# EAGLE design Amp (EAGLE 6.2)
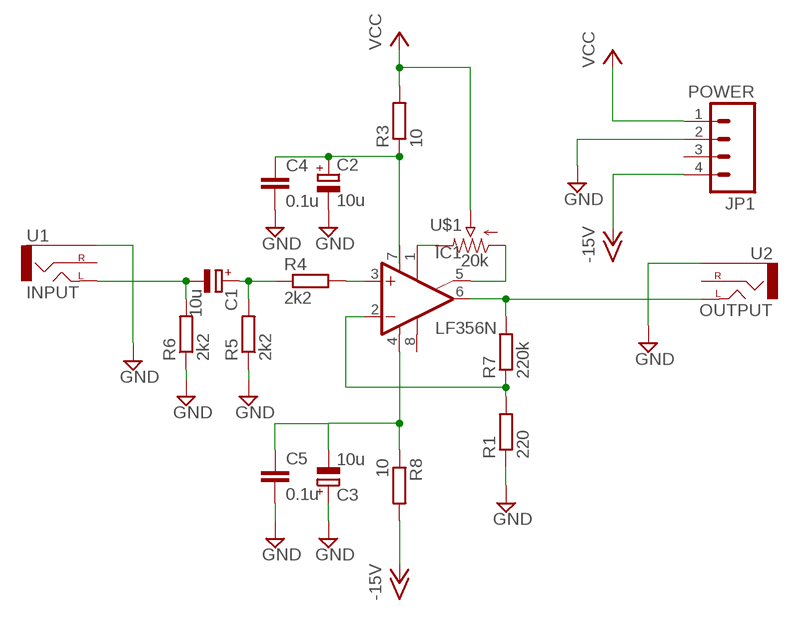
[diagram p0: schematic, sheet 1]

## Parts
C1  10u  CPOL-EUE1.8-4  [E1,8-4]
C2  10u  CPOL-EUE1.8-4  [E1,8-4]
C3  10u  CPOL-EUE1.8-4  [E1,8-4]
C4  0.1u  C-EU025-024X044  [C025-024X044]
C5  0.1u  C-EU025-024X044  [C025-024X044]
IC1  LF356N  [DIL08]
JP1  POWER  M04POLAR  [MOLEX-1X4]
R1  220  R-EU_0204/5  [0204/5]
R3  10  R-EU_0204/5  [0204/5]
R4  2k2  R-EU_0204/5  [0204/5]
R5  2k2  R-EU_0204/5  [0204/5]
R6  2k2  R-EU_0204/5  [0204/5]
R7  220k  R-EU_0204/5  [0204/5]
R8  10  R-EU_0204/5  [0204/5]
U1  INPUT  AUDIO-JACKHOLESONLY  [STEREOJACK2.5MM_SPECIAL_HOLES-ONLY]
U2  OUTPUT  AUDIO-JACKHOLESONLY  [STEREOJACK2.5MM_SPECIAL_HOLES-ONLY]
U$1  20k  POT100K_3362U  [3362U]

## Nets
-15V: JP1.4 R8.2
GND: C2.- C3.+ C4.2 C5.2 JP1.2 R1.1 R5.1 R6.1 U1.RING1(SLEEVE) U2.RING1(SLEEVE)
N$1: C1.- R6.2 U1.SHIELD(LEFT)
N$2: C1.+ R4.1 R5.2
N$4: IC1.2(-IN) R1.2 R7.1
N$5: C3.- C5.1 IC1.4(V-) R8.1
N$6: IC1.3(+IN) R4.2
N$7: IC1.6(OUT) R7.2 U2.SHIELD(LEFT)
N$9: C2.+ C4.1 IC1.7(V+) R3.1
N$12: IC1.5(ON2) U$1.P$3(A)
N$13: IC1.1(ON1) U$1.P$1(E)
VCC: JP1.1 R3.2 U$1.P$2(S)
Unconnected: IC1.8(OPT) JP1.3 U1.TIP(RIGHT) U2.TIP(RIGHT)

## Library data of the parts
C1-C3 = rcl:CPOL-EU: POLARIZED CAPACITOR, European symbol
C4 C5 = rcl:C-EU: CAPACITOR, European symbol
IC1 = linear:LF356: OP AMP
JP1 = SparkFun:M04: Header 4 Standard 4-pin 0.1" header. Use with straight break away headers (SKU : PRT-00116), right angle break away headers (PRT-00553), swiss pins (PRT-00743), machine pins (PRT-00117), and female headers (PRT-00115). Molex polarized connector foot print use with SKU : PRT-08231 with associated crimp pins and housings. 1MM SMD Version SKU: PRT-10208
R1 R3-R8 = rcl:R-EU_: RESISTOR, European symbol
U1 U2 = SparkFun:AUDIO-JACK: 3.5mm Audio Jack Simple 3.5mm common PCB mount audio jack. SKU: PRT-08032
U$1 = My Library:POT

## Board
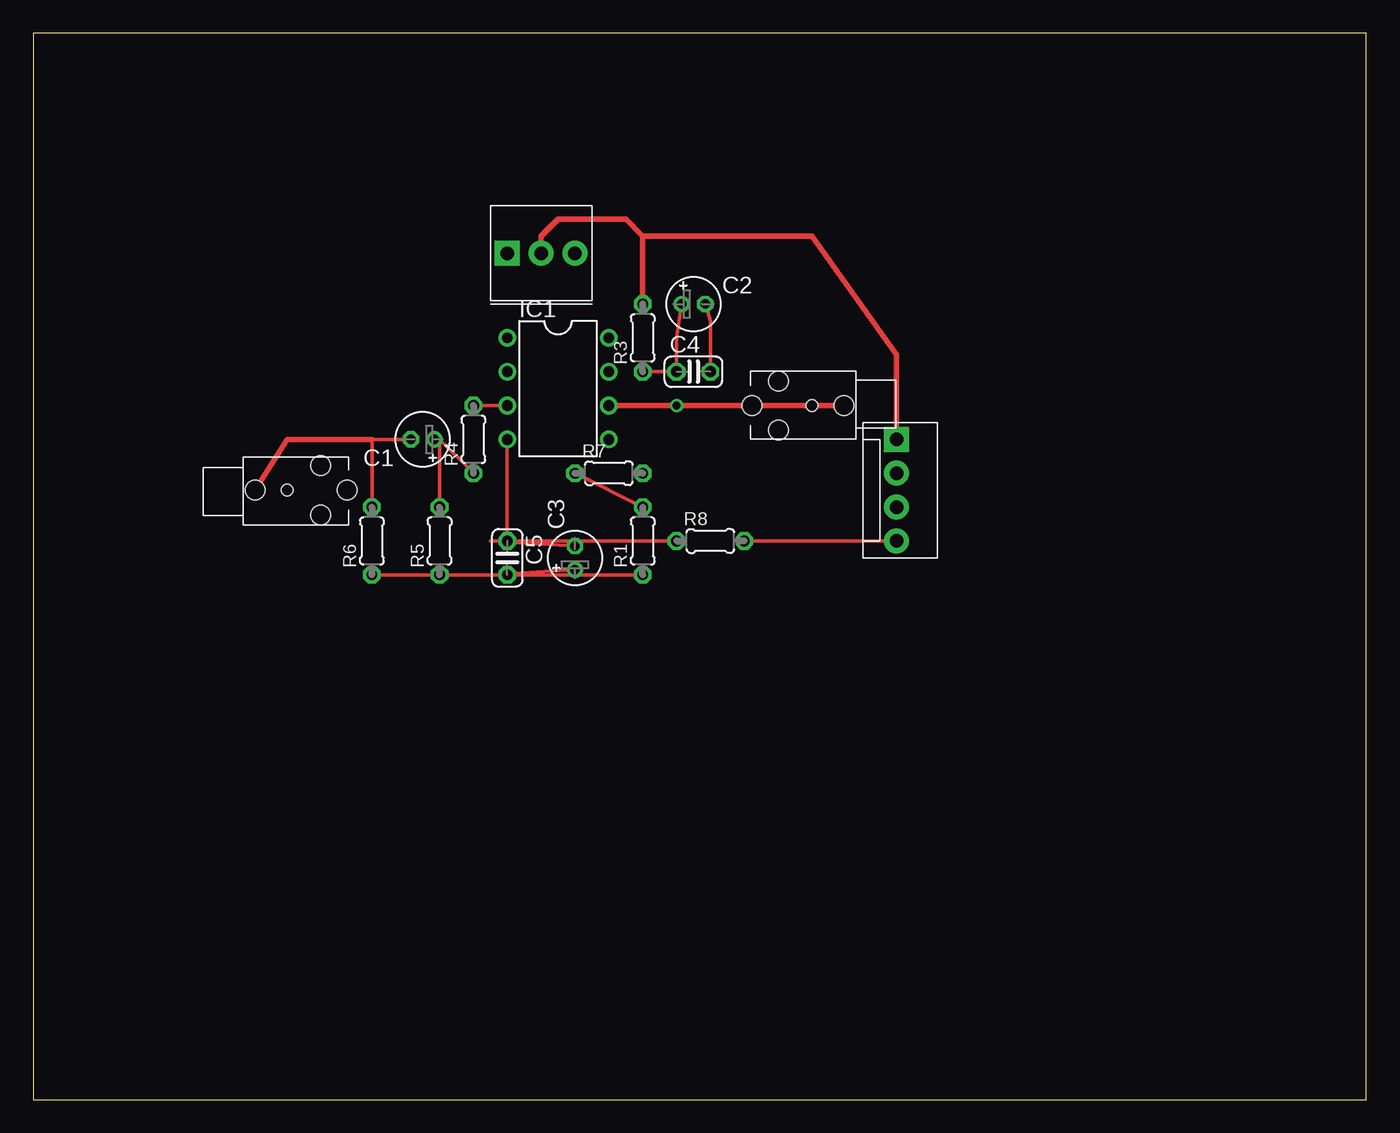
[diagram p1: board, top side]
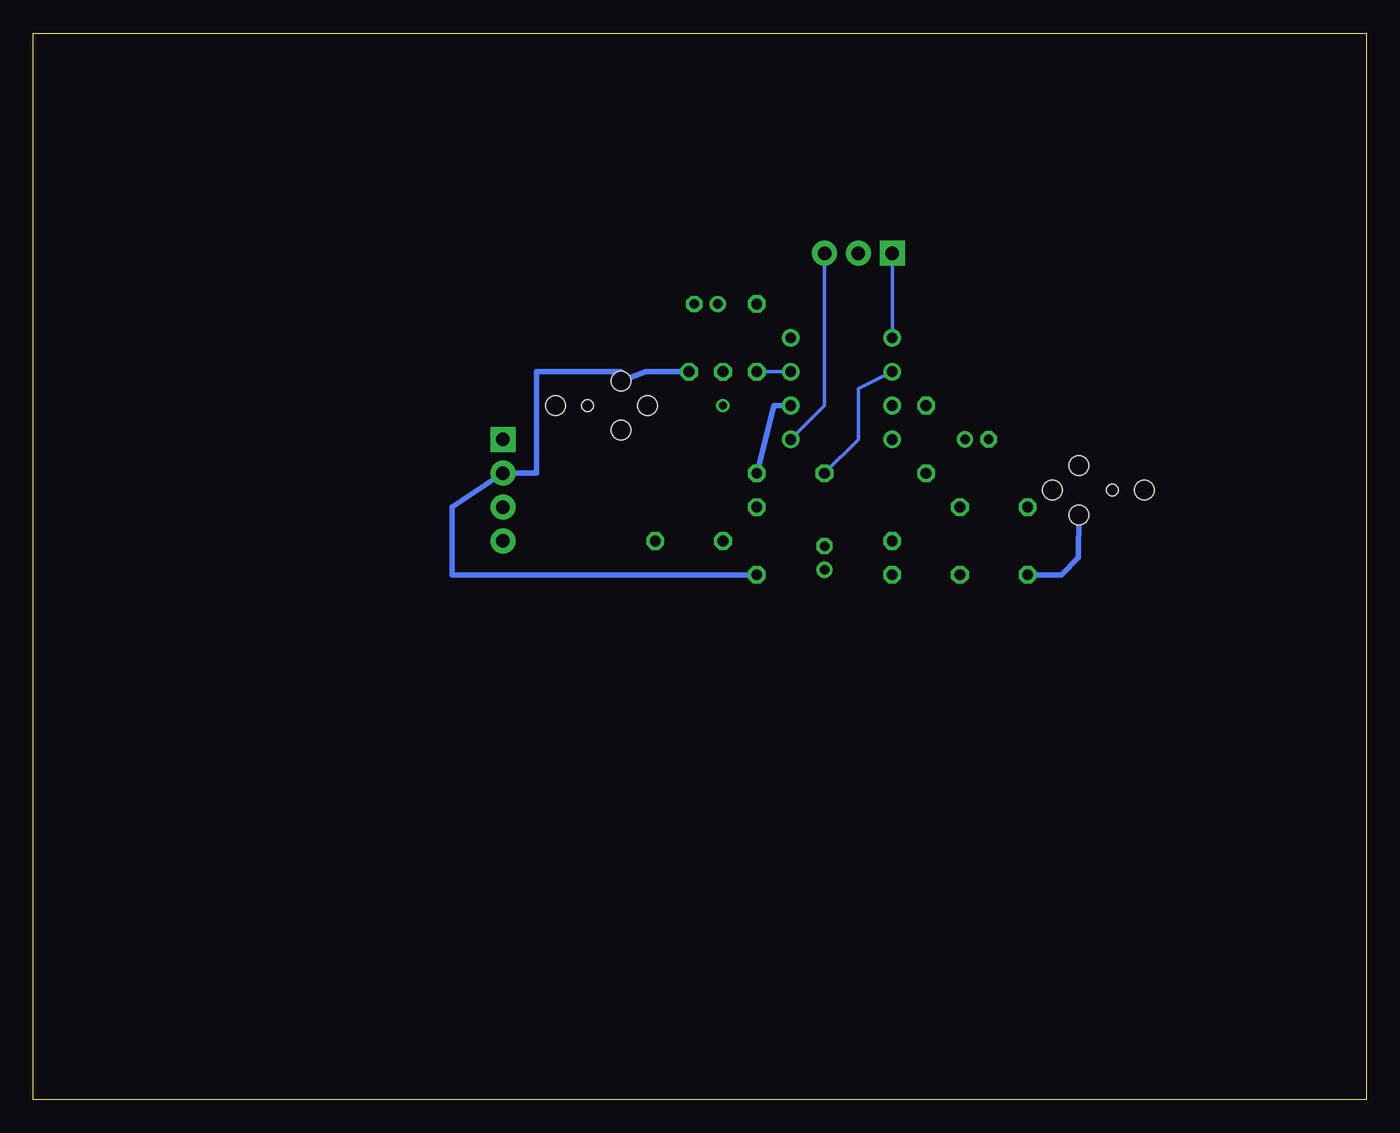
[diagram p2: board, bottom side, seen from below]

Size 100 x 80 mm. Coordinates in mm from the lower left corner, seen from the top.
Outline: 0,0 100,0 100,80 0,80 0,0
Copper layers (1*16): Top 0.035mm / dielectric 1.5mm / Bottom 0.035mm
Design rules: minimum track width 10mil, minimum drill 24mil, track to track 8mil, track to pad 8mil, pad to pad 8mil, via to via 8mil, smd to smd 8mil, copper to edge 40mil, drill to drill 8mil, minimum pad ring 10mil, minimum via ring 8mil, stop-mask expansion 4mil, vias tented up to drill 0mil, thermal gap 10mil

### Footprints (pad centres in the part's own frame; a part is rotated, then mirrored left to right if it is on the bottom)
E1,8-4 = drill 0.711 pad 1.168: + -0.889,0 | drill 0.711 pad 1.168 octagon: - 0.889,0
C025-024X044 = drill 0.813 octagon: 1 -1.27,0; 2 1.27,0
DIL08 = drill 0.813 pad 1.27: 1 -3.81,-3.81; 2 -1.27,-3.81; 3 1.27,-3.81; 4 3.81,-3.81; 5 3.81,3.81; 6 1.27,3.81; 7 -1.27,3.81; 8 -3.81,3.81
MOLEX-1X4 = drill 1.016 pad 1.88 square: 1 0,0 | drill 1.016 pad 1.88: 2 2.54,0; 3 5.08,0; 4 7.62,0
0204/5 = drill 0.813 octagon: 1 -2.54,0; 2 2.54,0
STEREOJACK2.5MM_SPECIAL_HOLES-ONLY = drill 0.889 pad 0.813: RING1 2.5,-1.85; RING2 2.5,1.85; SHIELD -2.4,0; TIP 4.5,0 | hole 0.889: 0,0 | hole 1.473: -2.4,0; 2.5,1.85; 4.5,0; 2.5,-1.85
3362U = drill 1.016 pad 1.88 square: P$1 0,2.54 | drill 1.016 pad 1.88: P$2 2.54,2.54; P$3 5.08,2.54

### Placement (x,y rotation side)
C1  29.21,49.53 180 top
C2  49.53,59.69 0 top
C3  40.64,40.64 90 top
C4  49.53,54.61 0 top
C5  35.56,40.64 270 top
IC1  39.37,53.34 270 top
JP1  64.77,49.53 270 top
R1  45.72,41.91 90 top
R3  45.72,57.15 90 top
R4  33.02,49.53 90 top
R5  30.48,41.91 90 top
R6  25.4,41.91 90 top
R7  43.18,46.99 0 top
R8  50.8,41.91 0 top
U1  19.05,45.72 0 top
U2  58.42,52.07 180 top
U$1  35.56,60.96 0 top

### Tracks (layer width: path | path; a pad name or v marks a point on that pad's centre or on a via)
-15V
  Top 0.254: JP1.4 59.69,41.91 R8.2
GND
  Top 0.254: R6.1 R5.1 C5.2 34.29,39.37 | 34.29,39.37 R1.1 | C4.2 50.8,58.42 C2.- | 34.29,39.37 C3.+
  Bottom 0.406: U1.RING1 21.59,40.68 22.86,39.37 R6.1 | C4.2 54.03,54.61 U2.RING1 55.92,54.61 62.23,54.61 62.23,46.99 JP1.2 68.58,44.45 68.58,39.37 R1.1
N$1
  Top 0.254: R6.2 25.4,49.53 C1.-
  Top 0.406: 25.4,49.53 19.05,49.53 U1.SHIELD
N$2
  Top 0.254: R4.1 30.48,49.53 | 30.48,49.53 C1.+ 30.48,49.53 | 30.48,49.53 R5.2
N$4
  Top 0.254: R7.1 R1.2
  Bottom 0.254: IC1.2 38.1,53.34 38.1,50.8 38.1,49.53 R7.1
N$5
  Top 0.254: C5.1 34.29,41.91 | 34.29,41.91 C5.1 | C5.1 R8.1 | C5.1 IC1.4 | 34.29,41.91 C3.-
N$6
  Top 0.254: IC1.3 R4.2
N$7
  Top 0.406: IC1.6 48.26,52.07 54.61,52.07 U2.SHIELD
  Bottom 0.406: IC1.6 44.45,52.07 R7.2
N$9
  Top 0.254: R3.1 C4.1 48.26,57.15 C2.+
  Bottom 0.254: R3.1 IC1.7
N$10  (via drill 0.6)
  other vias: 48.26,52.07
N$12
  Bottom 0.254: IC1.5 40.64,52.07 U$1.P$3
N$13
  Bottom 0.254: IC1.1 35.56,60.96 35.56,62.23 U$1.P$1
VCC
  Top 0.406: U$1.P$2 38.1,64.77 39.37,66.04 44.45,66.04 45.72,64.77 | 45.72,64.77 R3.2 45.72,64.77 | 45.72,64.77 58.42,64.77 64.77,55.88 JP1.1